# EAGLE design ACBoard (EAGLE 6.0)
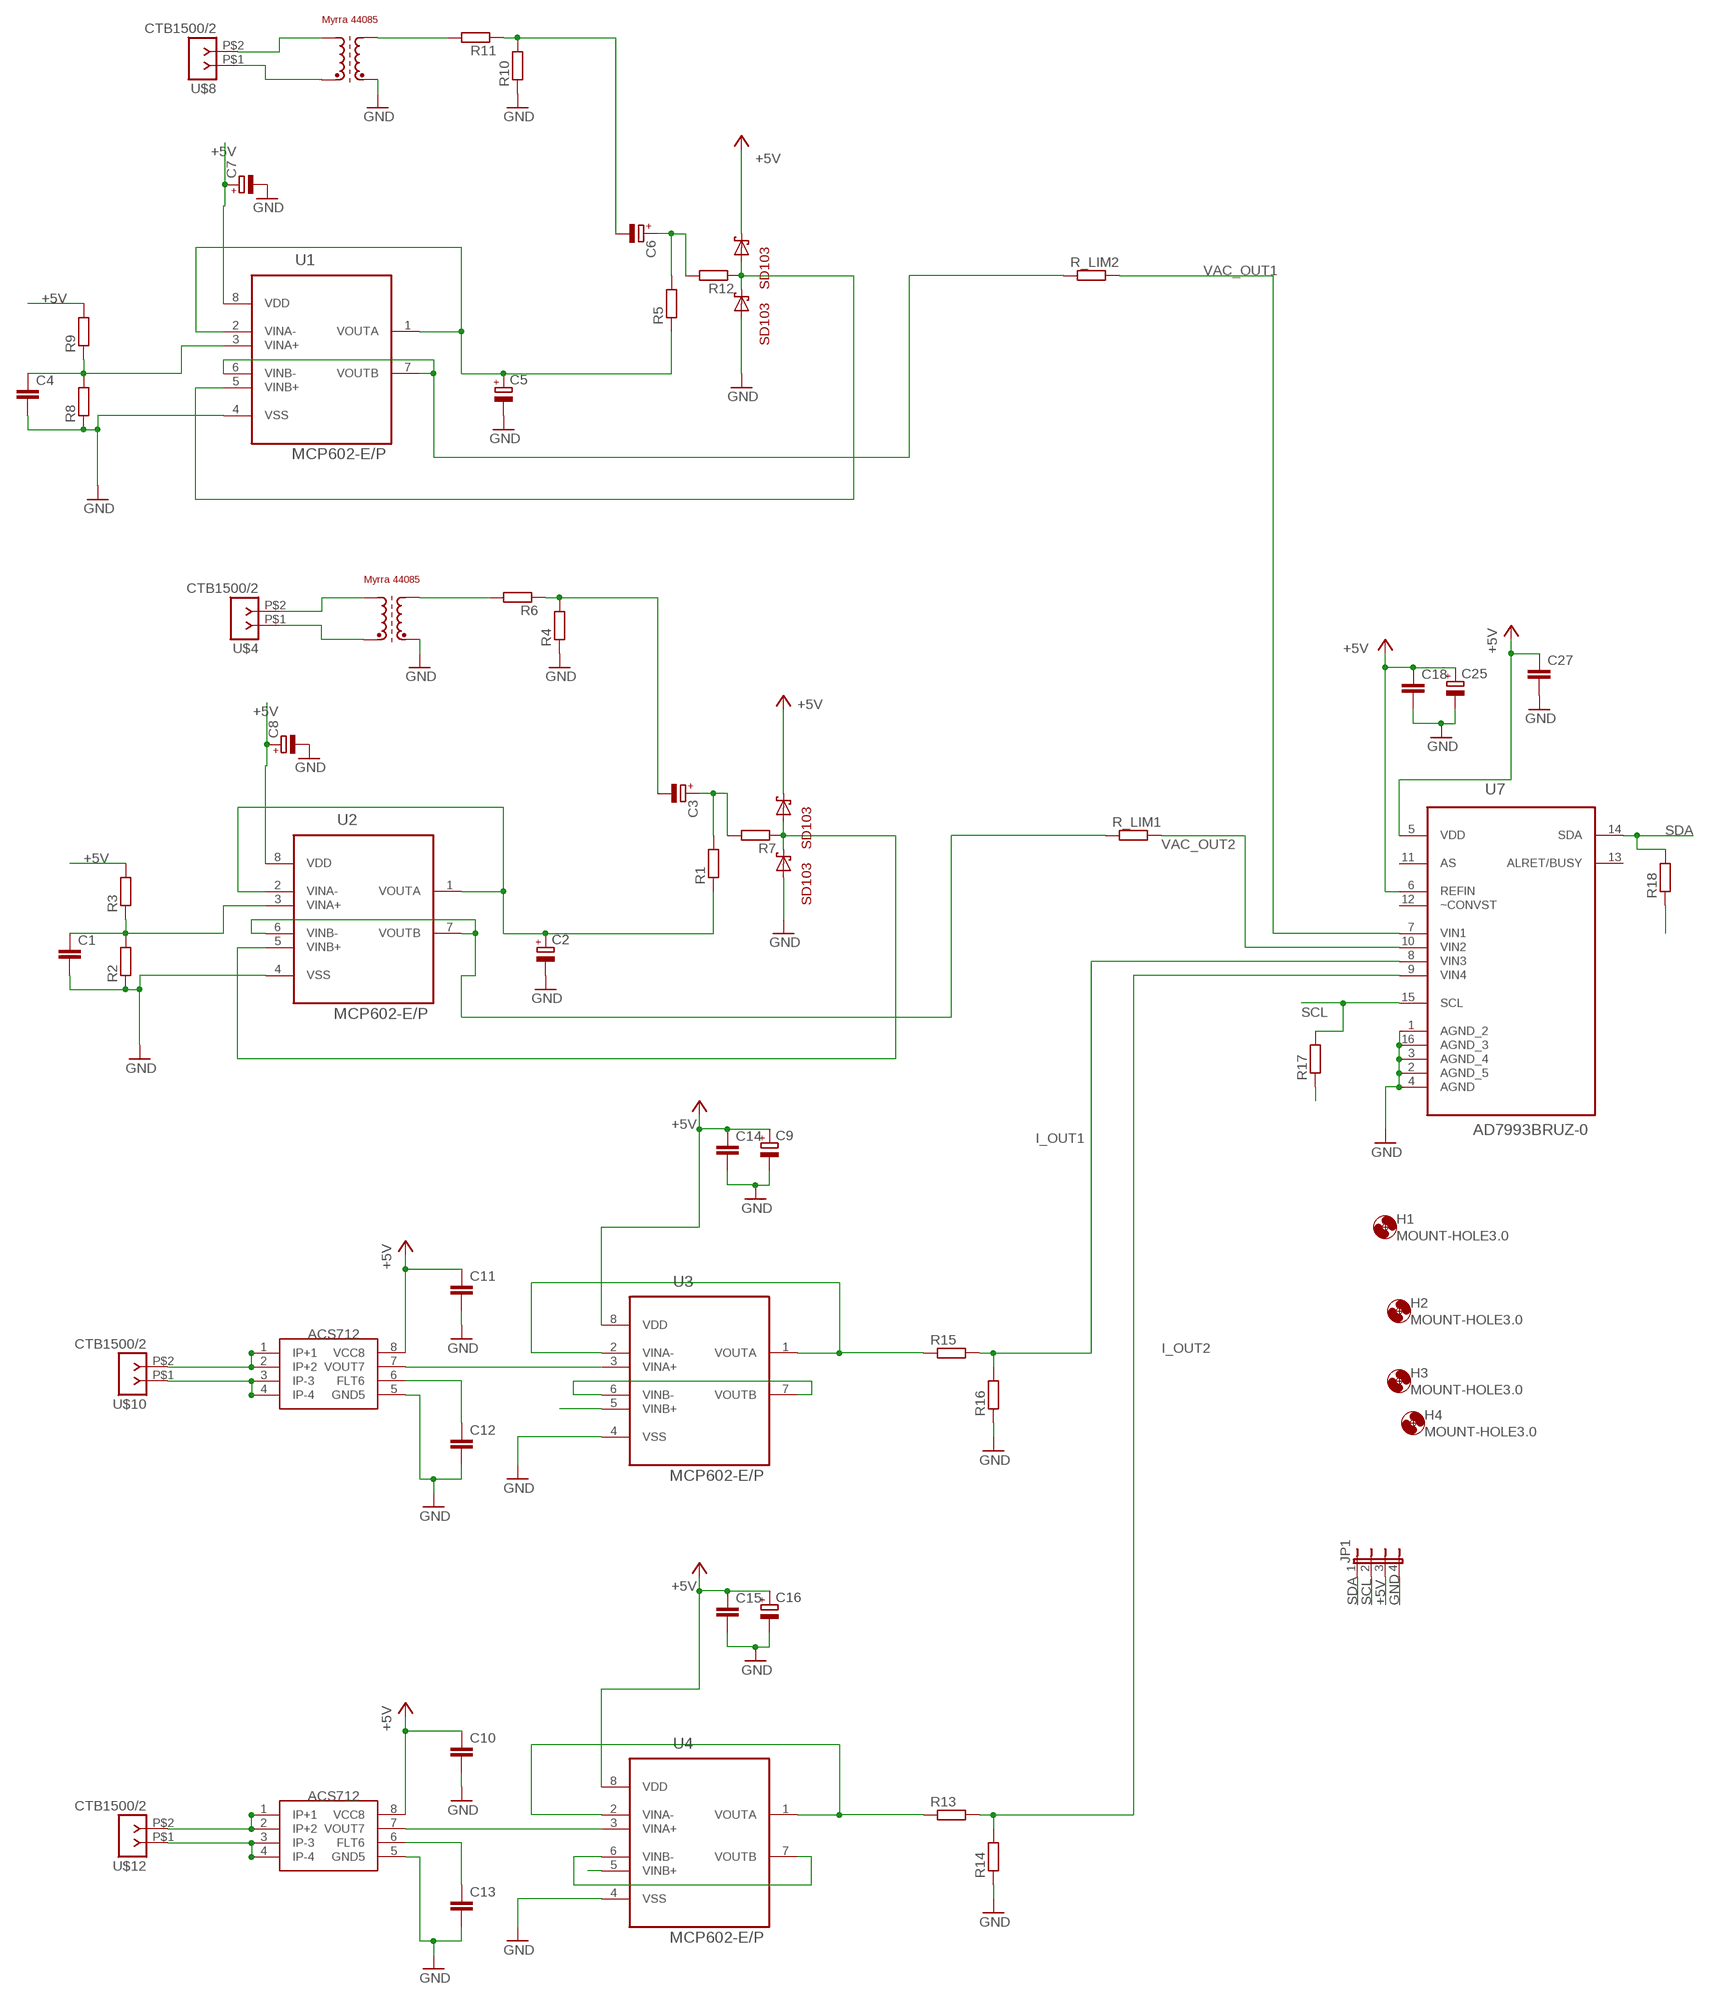
[diagram p0: schematic, sheet 1]

## Parts
C1  C5P  [C050-030-075]
C2  CPOL1  [E2,5-7---100UF]
C3  CPOL1  [E2,5-7---100UF]
C4  C5P  [C050-030-075]
C5  CPOL1  [E2,5-7---100UF]
C6  CPOL1  [E2,5-7---100UF]
C7  CPOL1  [E2,5-7---100UF]
C8  CPOL1  [E2,5-7---100UF]
C9  CPOL-EUE2-4  [E2-4]
C10  C-EU025-024X044  [C025-024X044]
C11  C-EU025-024X044  [C025-024X044]
C12  C-EU025-024X044  [C025-024X044]
C13  C-EU025-024X044  [C025-024X044]
C14  C-EU025-024X044  [C025-024X044]
C15  C-EU025-024X044  [C025-024X044]
C16  CPOL-EUE2-4  [E2-4]
C18  C-EU025-024X044  [C025-024X044]
C25  CPOL-EUE2-4  [E2-4]
C27  C-EU025-025X050  [C025-025X050]
H1  MOUNT-HOLE3.0  [3,0]
H2  MOUNT-HOLE3.0  [3,0]
H3  MOUNT-HOLE3.0  [3,0]
H4  MOUNT-HOLE3.0  [3,0]
JP1  JP4E  [JP4]
R1  R  [0207/10]
R2  R  [0207/10]
R3  R  [0207/10]
R4  R  [0207/10]
R5  R  [0207/10]
R6  R  [0207/10]
R7  R  [0207/10]
R8  R  [0207/10]
R9  R  [0207/10]
R10  R  [0207/10]
R11  R  [0207/10]
R12  R  [0207/10]
R13  R-EU_0207/7  [0207/7]
R14  R-EU_0207/7  [0207/7]
R15  R-EU_0207/7  [0207/7]
R16  R-EU_0207/7  [0207/7]
R17  R-EU_0207/7  [0207/7]
R18  R-EU_0207/7  [0207/7]
R_LIM1  R  [0207/10]
R_LIM2  R  [0207/10]
U1  MCP602-E/P  [DIP254P762X508-8P]
U2  MCP602-E/P  [DIP254P762X508-8P]
U3  MCP602-E/P  [DIP254P762X508-8P]
U4  MCP602-E/P  [DIP254P762X508-8P]
U7  AD7993BRUZ-0  [SOP65P640X120-16N]
U$1  MYRRA_4408  [4408]
U$2  SD103A  [D035-10]
U$3  SD103A  [D035-10]
U$4  CTB1500/2  [CTB1500-2]
U$5  MYRRA_4408  [4408]
U$6  SD103A  [D035-10]
U$7  SD103A  [D035-10]
U$8  CTB1500/2  [CTB1500-2]
U$9  ACS712  [SO8]
U$10  CTB1500/2  [CTB1500-2]
U$11  ACS712  [SO8]
U$12  CTB1500/2  [CTB1500-2]

## Nets
+5V: C7.+ C8.+ C9.+ C10.1 C11.1 C14.1 C15.1 C16.+ C18.1 C25.+ C27.1 JP1.3 R3.2 R9.2 R17.1 R18.1 U1.8(VDD) U2.8(VDD) U3.8(VDD) U4.8(VDD) U7.5(VDD) U7.6(REFIN) U$2.C U$6.C U$9.8(VCC8) U$11.8(VCC8) ; supply symbol labelled +3V3
GND: C1.2 C2.- C4.2 C5.- C7.- C8.- C9.- C10.2 C11.2 C12.2 C13.2 C14.2 C15.2 C16.- C18.2 C25.- C27.2 JP1.4 R2.1 R4.1 R8.1 R10.1 R14.1 R16.1 U1.4(VSS) U2.4(VSS) U3.4(VSS) U3.5(VINB+) U4.4(VSS) U4.5(VINB+) U7.1(AGND_2) U7.2(AGND_5) U7.3(AGND_4) U7.4(AGND) U7.16(AGND_3) U$1.PIN9(E2) U$3.A U$5.PIN9(E2) U$7.A U$9.5(GND5) U$11.5(GND5)
I_OUT1: R15.2 R16.2 U7.8(VIN3)
I_OUT2: R13.2 R14.2 U7.9(VIN4)
IOUTOP: R15.1 U3.1(VOUTA) U3.2(VINA-)
IOUTOP2: R13.1 U4.1(VOUTA) U4.2(VINA-)
N$1: R_LIM2.1 U1.6(VINB-) U1.7(VOUTB)
N$2: C5.+ R5.1 U1.1(VOUTA) U1.2(VINA-)
N$3: C1.1 R2.2 R3.1 U2.3(VINA+)
N$4: R7.1 U2.5(VINB+) U$2.A U$3.C
N$5: C3.- R4.2 R6.1
N$6: U$9.3(IP-3) U$9.4(IP-4) U$10.P$1
N$7: R6.2 U$1.PIN7(A2)
N$8: C12.1 U$9.6(FLT6)
N$9: C3.+ R1.2 R7.2
N$10: C4.1 R8.2 R9.1 U1.3(VINA+)
N$11: U$5.PIN5(A1) U$8.P$2
N$12: R12.1 U1.5(VINB+) U$6.A U$7.C
N$13: C2.+ R1.1 U2.1(VOUTA) U2.2(VINA-)
N$14: R_LIM1.1 U2.6(VINB-) U2.7(VOUTB)
N$15: U$5.PIN1(E1) U$8.P$1
N$16: U3.3(VINA+) U$9.7(VOUT7)
N$17: C6.- R10.2 R11.1
N$18: R11.2 U$5.PIN7(A2)
N$19: U$1.PIN5(A1) U$4.P$2
N$20: U$9.1(IP+1) U$9.2(IP+2) U$10.P$2
N$21: C6.+ R5.2 R12.2
N$22: U$11.3(IP-3) U$11.4(IP-4) U$12.P$1
N$23: C13.1 U$11.6(FLT6)
N$24: U4.3(VINA+) U$11.7(VOUT7)
N$25: U$11.1(IP+1) U$11.2(IP+2) U$12.P$2
N$26: U$1.PIN1(E1) U$4.P$1
N$27: U4.6(VINB-) U4.7(VOUTB)
N$28: U3.6(VINB-) U3.7(VOUTB)
SCL: JP1.2 R17.2 U7.15(SCL)
SDA: JP1.1 R18.2 U7.14(SDA)
VAC_OUT1: R_LIM2.2 U7.7(VIN1)
VAC_OUT2: R_LIM1.2 U7.10(VIN2)
Unconnected: U7.11(AS) U7.12(~CONVST) U7.13(ALRET/BUSY)

## Library data of the parts
C1 C4 = ee2parts:C: Capacitor
C2 C3 C5-C8 = ee2parts:CPOL: Electrolytic (polarised) capacitor
C9 C16 C25 = resistor:CPOL-EU: POLARIZED CAPACITOR, European symbol
C10-C15 C18 C27 = resistor:C-EU: CAPACITOR, European symbol
H1-H4 = holes:MOUNT-HOLE: MOUNTING HOLE with drill center marker
JP1 = jumper:JP4E: JUMPER
R1-R12 R_LIM1 R_LIM2 = ee2parts:R: Resistor
R13-R18 = resistor:R-EU_: RESISTOR, European symbol
U1-U4 = MCP:MCP602-E/P: IC, 2.7V to 5.5V Single-Supply CMOS Dual Op Amps,DIP-8; MPN: MCP602-E/P; OC_FARNELL: 1852042; OC_NEWARK: 88H9870; PACKAGE: DIP-8; SUPPLIER: Microchip
U7 = ADC:AD7993BRUZ-0: ADC; MPN: AD7993BRUZ-0; OC_FARNELL: 1078309; OC_NEWARK: 59K6101; PACKAGE: TSSOP-16; SUPPLIER: Analog Devices
U$1 U$5 = Pauls_parts:MYRRA_4408
U$2 U$3 U$6 U$7 = Pauls_parts:SD103A
U$4 U$8 U$10 U$12 = eko-parts:CTB1500/2
U$9 U$11 = eko-parts:ACS712

## Board
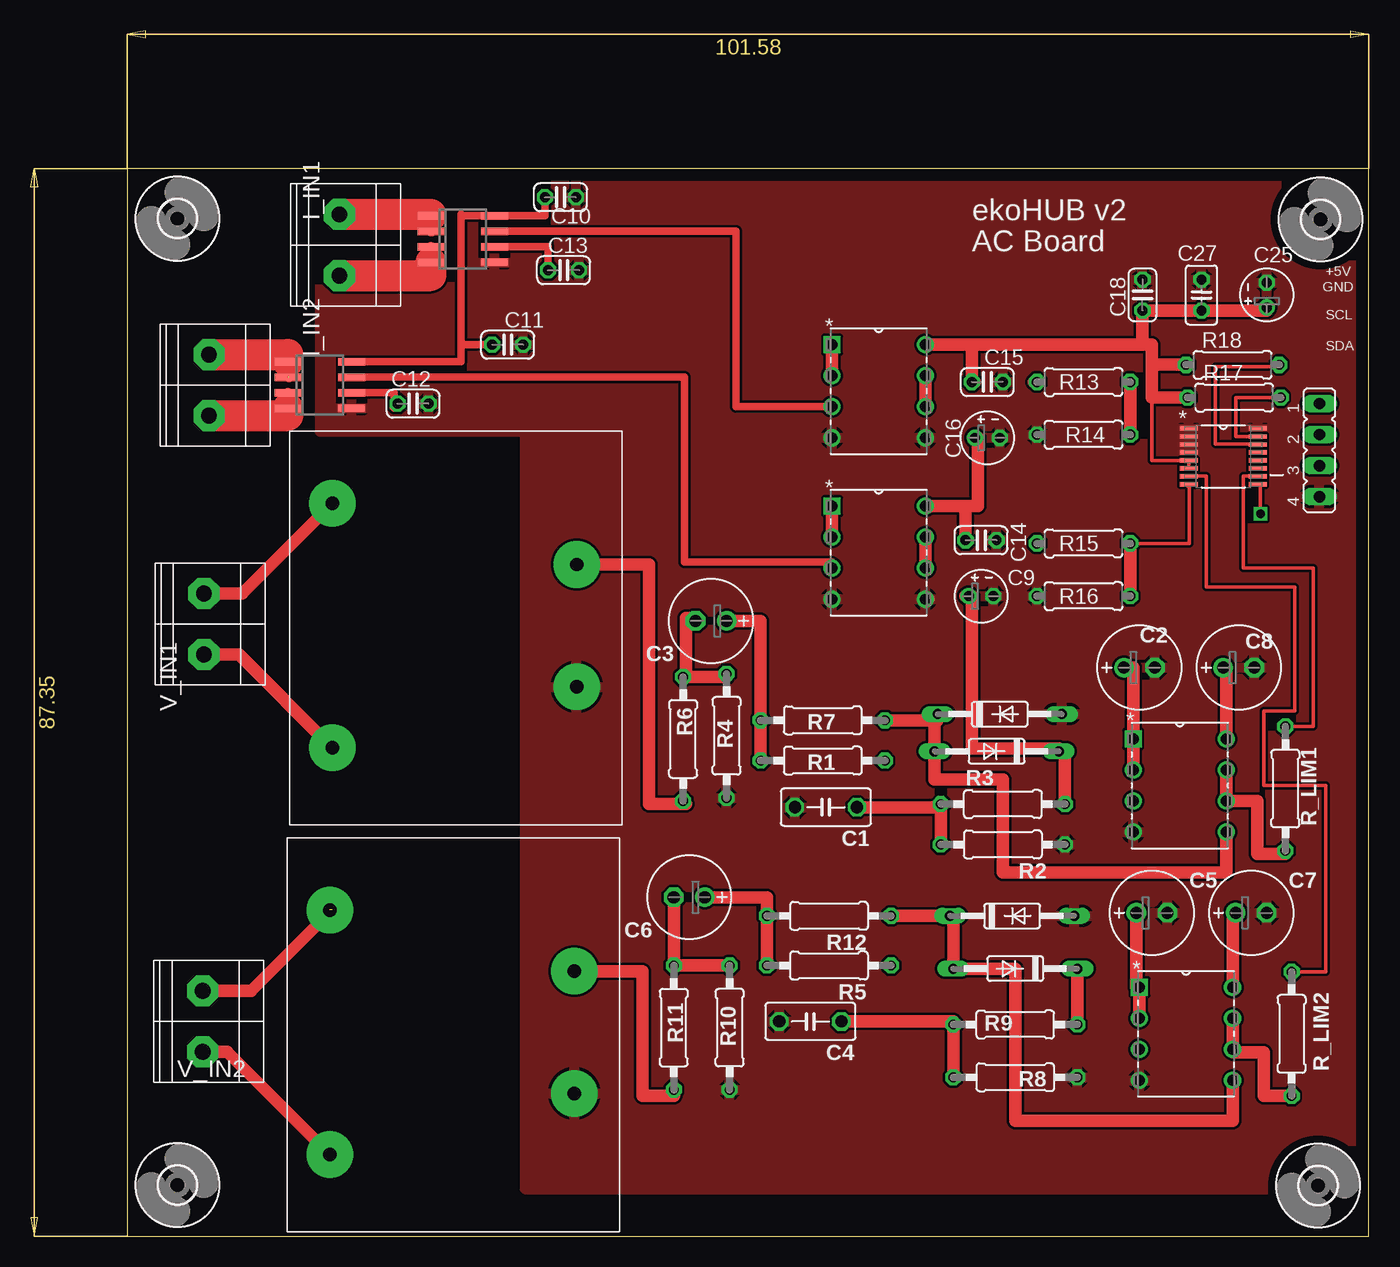
[diagram p1: board, top side]
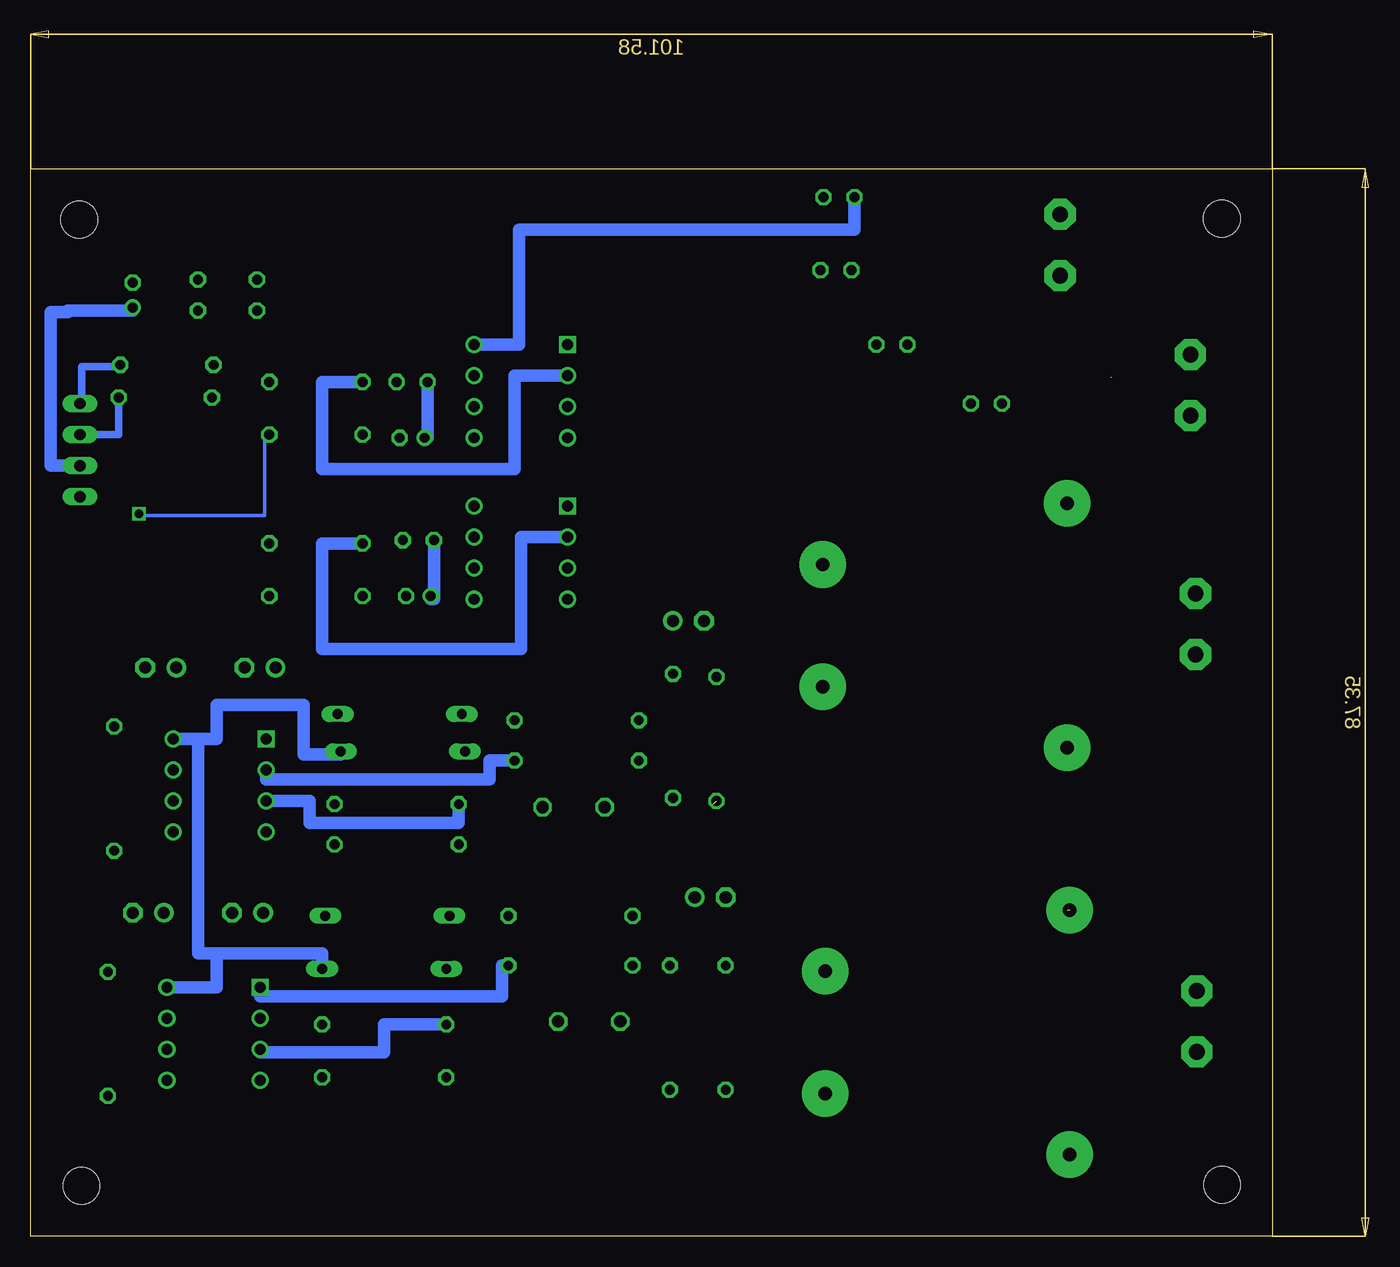
[diagram p2: board, bottom side, seen from below]

Size 101.58 x 87.35 mm. Coordinates in mm from the lower left corner, seen from the top.
Outline: 0,0 101.58,0 101.58,87.35 0,87.35 0,0
Copper layers (1*16): Top 0.035mm / dielectric 1.5mm / Bottom 0.035mm
Design rules: minimum track width 10mil, minimum drill 24mil, track to track 8mil, track to pad 8mil, pad to pad 8mil, via to via 8mil, smd to smd 8mil, copper to edge 40mil, drill to drill 0.4mm, minimum pad ring 10mil, minimum via ring 8mil, stop-mask expansion 4mil, vias tented up to drill 0mil, thermal gap 10mil

### Footprints (pad centres in the part's own frame; a part is rotated, then mirrored left to right if it is on the bottom)
C050-030-075 = drill 1 octagon: 1 -2.54,0; 2 2.54,0
E2,5-7---100UF = drill 1 pad 1.6: + -1.27,0 | drill 1 pad 1.6 octagon: - 1.27,0
E2-4 = drill 0.813 pad 1.27: + -1.016,0 | drill 0.813 pad 1.27 octagon: - 1.016,0
C025-024X044 = drill 0.813 octagon: 1 -1.27,0; 2 1.27,0
C025-025X050 = drill 0.813 octagon: 1 -1.27,0; 2 1.27,0
3,0 = hole 3: 0,0
JP4 = drill 0.914 long: 1 -3.81,0; 2 -1.27,0; 3 1.27,0; 4 3.81,0
0207/10 = drill 0.8 octagon: 1 -5.08,0; 2 5.08,0
0207/7 = drill 0.813 octagon: 1 -3.81,0; 2 3.81,0
DIP254P762X508-8P = drill 0.889 square: 1 -7.62,7.62 | drill 0.889: 2 -7.62,5.08; 3 -7.62,2.54; 4 -7.62,0; 5 0,0; 6 0,2.54; 7 0,5.08; 8 0,7.62
SOP65P640X120-16N = smd 1.473 x 0.356: 1 -2.819,2.286; 2 -2.819,1.626; 3 -2.819,0.965; 4 -2.819,0.33; 5 -2.819,-0.33; 6 -2.819,-0.965; 7 -2.819,-1.626; 8 -2.819,-2.286; 9 2.819,-2.286; 10 2.819,-1.626; 11 2.819,-0.965; 12 2.819,-0.33; 13 2.819,0.33; 14 2.819,0.965; 15 2.819,1.626; 16 2.819,2.286
4408 = drill 1.1 pad 3.81: PIN1 -10,10; PIN5 10,10; PIN7 5,-10; PIN9 -5,-10
D035-10 = drill 0.813 long: A 4.318,0.762; C -5.842,0.762
CTB1500-2 = drill 1.3 pad 2.54 octagon: P$1 -2.5,0.5; P$2 2.5,0.5
SO8 = smd 0.6 x 2.2: 1 -1.905,-2.6; 2 -0.635,-2.6; 3 0.635,-2.6; 4 1.905,-2.6; 5 1.905,2.6; 6 0.635,2.6; 7 -0.635,2.6; 8 -1.905,2.6

### Placement (x,y rotation side)
C1  57.15,35.1 180 top
C2  82.8,46.53 0 top
C3  47.75,50.34 180 top
C4  55.88,17.58 180 top
C5  83.82,26.47 0 top
C6  45.97,27.74 180 top
C7  91.95,26.47 0 top
C8  90.93,46.53 0 top
C9  69.85,52.38 0 top
C10  35.43,85.01 0 top
C11  31.11,72.95 0 top
C12  23.37,68.12 0 top
C13  35.69,79.05 0 top
C14  69.85,56.95 0 top
C15  70.36,69.9 0 top
C16  70.36,65.33 0 top
C18  83.06,77.01 90 top
C25  93.22,77.01 90 top
C27  87.88,77.01 90 top
H1  4.09,4.2 0 top
H2  97.41,4.15 0 top
H3  97.61,83.19 0 top
H4  4.1,83.27 0 top
JP1  97.54,64.31 270 top
R1  56.9,38.91 180 top
R2  71.63,32.05 180 top
R3  71.63,35.36 0 top
R4  49.02,40.95 90 top
R5  57.4,22.15 180 top
R6  45.47,40.69 270 top
R7  56.9,42.21 180 top
R8  72.64,13.01 180 top
R9  72.64,17.32 0 top
R10  49.28,17.07 90 top
R11  44.7,17.07 270 top
R12  57.4,26.21 180 top
R13  78.23,69.9 0 top
R14  78.23,65.58 0 top
R15  78.23,56.69 0 top
R16  78.23,52.38 0 top
R17  90.55,68.63 0 top
R18  90.42,71.3 0 top
R_LIM1  94.74,36.63 90 top
R_LIM2  95.25,16.56 90 top
U1  90.42,12.75 0 top
U2  89.92,33.07 0 top
U3  65.28,52.12 0 top
U4  65.28,65.33 0 top
U7  89.66,63.8 0 top
U$1  26.77,49.96 90 top
U$2  70.36,40.44 180 top
U$3  72.14,41.96 0 top
U$4  6.76,50.09 90 top
U$5  26.57,16.69 90 top
U$6  71.88,22.66 180 top
U$7  73.15,25.45 0 top
U$8  6.65,17.58 90 top
U$9  15.75,69.65 270 top
U$10  7.18,69.65 90 top
U$11  27.43,81.58 270 top
U$12  17.84,81.11 90 top

### Tracks (layer width: path | path; a pad name or v marks a point on that pad's centre or on a via)
+5V
  Top 0.305: U7.6 U7.5 83.82,63.47 83.82,69.01
  Top 0.406: 69.34,69.9 69.22,69.9 69.22,69.77
  Top 0.61: 27.3,83.49 U$11.8 34.16,83.49 C10.1 | U$9.8 27.3,71.55 27.3,72.95 | 27.3,72.95 27.3,83.49 | 27.3,83.49 27.3,83.62 | C11.1 27.3,72.95
  Top 1.016: U$6.C R9.2 | C7.+ 90.42,26.47 U1.8 | R3.2 76.71,39.67 U$2.C 76.2,39.93 69.09,39.93 69.09,52.38 C9.+ 68.58,52.38 | C8.+ 89.92,46.53 U2.8 | U3.8 68.58,59.74 | 68.58,59.74 C14.1 | U4.8 69.09,72.95 | 69.09,72.95 C15.1 69.34,69.9 | C16.+ 69.6,65.33 69.6,59.74 68.58,59.74 | C25.+ 93.22,75.74 C27.1 C18.1 83.06,72.95 | 69.09,72.95 83.06,72.95 | R17.1 83.82,68.63 83.82,69.01 83.82,71.3 | R18.1 83.82,71.3 | 83.06,72.95 83.82,72.95 83.82,71.3
  Bottom 1.016: U2.8 87.88,40.69 | 87.88,40.69 86.36,40.69 86.36,43.48 79.25,43.48 79.25,39.42 76.2,39.42 U$2.C | U1.8 86.36,20.37 86.36,23.16 | U$6.C 77.72,23.16 86.36,23.16 | 86.36,23.16 87.88,23.16 87.88,40.69 | C25.+ 93.22,75.74 98.55,75.74 98.55,75.62 99.95,75.62 99.95,63.04 JP1.3 | C14.1 68.58,52.12 68.83,52.12 C9.+ | C16.+ 69.09,65.33 C15.1 | U4.8 61.59,72.95 61.59,82.35 34.16,82.35 C10.1
GND
  Top 0.406: C16.- 71.37,65.2
  Top 1.016: U3.5 65.53,52.12
  pour Top (rank 3): 32.51,3.86 101.6,3.86 101.6,86.66 15.75,86.66 15.75,65.84 32.51,65.84
I_OUT1
  Top 0.305: R15.2 86.87,56.69 86.87,61.39 86.74,61.39 86.74,61.52 U7.8
  Top 1.016: R16.2 R15.2
I_OUT2  (via drill 0.7)
  Top 0.305: U7.9 92.71,61.52 v92.71,59.11 92.71,58.98
  Top 1.016: R13.2 R14.2
  Bottom 0.305: R14.2 82.42,65.58 82.42,58.98 92.71,58.98 v92.71,59.11
IOUTOP
  Top 1.016: U3.1 U3.2
  Bottom 1.016: U3.2 61.47,57.2 61.47,48.06 77.72,48.06 77.72,56.69 R15.1
IOUTOP2
  Top 1.016: U4.1 U4.2 | R13.1 74.17,69.9
  Bottom 1.016: U4.2 61.98,70.41 61.98,62.79 77.72,62.79 77.72,69.9 R13.1
N$1
  Top 1.016: R_LIM2.1 92.96,11.48 92.96,15.04 90.42,15.04 U1.6 U1.7
N$2
  Top 1.016: U1.2 U1.1 82.55,20.37 C5.+
  Bottom 1.016: R5.1 62.99,22.15 62.99,19.61 82.8,19.61 U1.1
N$3
  Top 1.016: C1.1 66.55,35.1 | 66.55,35.1 R3.1 | 66.55,35.1 R2.2
  Bottom 1.016: U2.3 78.74,35.61 78.74,33.83 66.55,33.83 R3.1
N$4
  Top 1.016: R7.1 66.04,42.21 | U$3.C 66.29,42.21 66.04,42.21 | 66.04,42.21 U$2.A 66.04,37.39 71.63,37.39 71.63,29.77 89.92,29.77 U2.5
N$5
  Top 1.016: C3.- 46.48,50.6 45.72,50.6 45.72,45.77 R6.1 49.02,45.77 R4.2
N$6
  Top 0.813: U$9.3 U$9.4
  Top 2.54: U$10.P$1 13.15,67.15 U$9.4
N$7  (1 unrouted)
  Top 1.016: U$1.PIN7 42.67,54.96 42.67,35.36 45.72,35.36
N$8
  Top 0.61: U$9.6 21.84,69.01 21.84,67.87
  Top 0.813: 21.84,67.87 22.1,67.87 C12.1
N$9
  Top 1.016: C3.+ 51.82,50.34 R7.2 R1.2
N$10
  Top 1.016: C4.1 67.56,17.58 R9.1 R8.2
  Bottom 1.016: R9.1 72.64,17.32 72.64,15.04 82.8,15.04 U1.3
N$11  (1 unrouted)
  Top 1.016: 17.27,26.72 17.27,27.23 16.57,27.23 U$5.PIN5 | U$8.P$2 10.12,20.08 16.76,26.72
N$12
  Top 1.016: R12.1 U$7.C 67.56,26.21 U$6.A 72.64,21.89 72.64,9.45 90.42,9.45 U1.5
N$13
  Top 1.016: U2.2 U2.1 82.3,46.53 C2.+
  Bottom 1.016: R1.1 64.01,38.91 64.01,37.39 82.3,37.39 U2.2
N$14
  Top 1.016: R_LIM1.1 94.74,31.29 92.46,31.29 92.46,35.61 U2.6 U2.7
N$15
  Top 1.016: 16.57,6.4 U$5.PIN1 8.18,15.08 U$8.P$1
N$16
  Top 0.61: U$9.7 45.59,70.28 45.59,55.17 57.66,55.17 U3.3
N$17
  Top 1.016: R10.2 R11.1 C6.-
N$18
  Top 1.016: U$5.PIN7 42.16,21.69 42.16,11.48 44.7,11.48 R11.2
N$19
  Top 1.016: 6.1,52.59 U$4.P$2 9.39,52.59 U$1.PIN5 16.77,60.25
N$20  (1 unrouted)
  Top 0.61: U$9.1 13.21,71.55 13.21,71.42 13.21,70.41
  Top 0.813: 13.21,70.28 13.21,71.42
  Top 2.54: U$10.P$2 13.15,72.15 U$9.1
N$21
  Top 1.016: C6.+ 52.32,27.74 R12.2 R5.2
N$22
  Top 0.813: U$11.3 U$11.4
  Top 2.54: U$12.P$1 24.83,78.61 U$11.4
N$23
  Top 0.61: U$11.6 34.42,80.95 C13.1
N$24
  Top 0.61: U$11.7 49.78,82.22 49.78,67.87 U4.3
N$25
  Top 0.813: U$11.2 24.89,82.22 24.89,83.62 24.83,83.62
  Top 2.54: U$12.P$2 24.38,83.61 24.38,83.62 24.83,83.62 U$11.1
N$26
  Top 1.016: 16.77,39.42 U$1.PIN1 9.14,47.59 U$4.P$1
N$27
  Top 1.016: U4.7 U4.6
N$28
  Top 1.016: U3.7 U3.6
SCL
  Top 0.305: 97.54,65.46 JP1.2 | U7.15 90.68,65.43 90.68,68.63 R17.2 94.36,68.5
  Bottom 0.61: JP1.2 94.36,65.58 R17.2
SDA
  Top 0.305: U7.14 92.48,64.82 89.03,64.82 89.03,71.17 94.23,71.17 R18.2
  Bottom 0.61: JP1.1 97.41,68.12 97.41,71.17 94.23,71.17 R18.2
VAC_OUT1
  Top 0.305: R_LIM2.2 98.04,21.64 98.04,36.88 92.96,36.88 92.96,42.98 95.5,42.98 95.5,53.14 88.27,53.14 88.27,62.18 U7.7
VAC_OUT2
  Top 0.305: R_LIM1.2 97.03,41.71 97.03,54.66 91.31,54.66 91.31,62.18 U7.10

### Text on the board
tPlace: I_IN1 | ekoHUB v2 | AC Board | +5V | GND | SCL | SDA | I_IN2 | V_IN1 | V_IN2